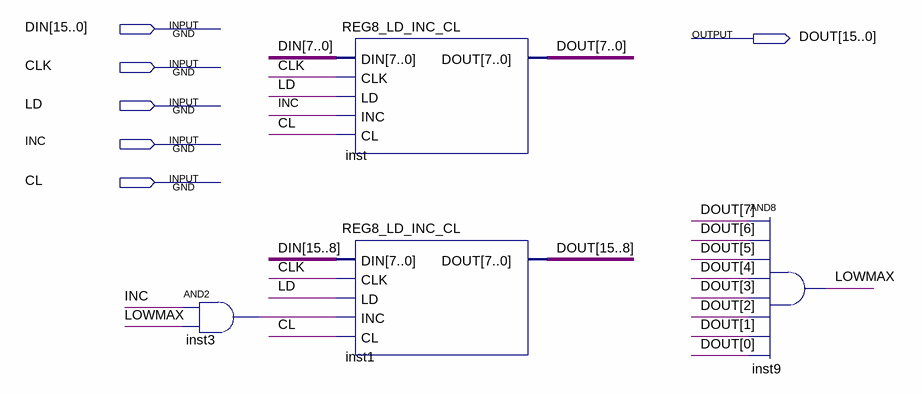
[diagram p0: schematic sheet]
// Quartus schematic REG16_LD_INC_CL.bdf as structural Verilog: 4 symbols, 6 pins
module REG16_LD_INC_CL (
  input  [15:0] DIN,
  input  CLK,
  input  LD,
  input  INC,
  input  CL,
  output [15:0] DOUT
);

  wire inst3_out, LOWMAX;

  and inst3 (inst3_out, INC, LOWMAX);
  REG8_LD_INC_CL inst (.DIN(DIN[7:0]), .CLK(CLK), .LD(LD), .INC(INC), .CL(CL), .DOUT(DOUT[7:0]));
  REG8_LD_INC_CL inst1 (.DIN(DIN[15:8]), .CLK(CLK), .LD(LD), .INC(inst3_out), .CL(CL), .DOUT(DOUT[15:8]));
  and inst9 (LOWMAX, DOUT[7], DOUT[6], DOUT[5], DOUT[4], DOUT[3], DOUT[2], DOUT[1], DOUT[0]);
endmodule
